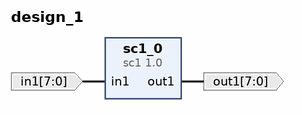
[diagram p0: block diagram of the top level]
# Vivado block design design_1, xc7a100tcsg324-1, Vivado 2023.2
create_bd_design design_1

create_bd_port -dir I -from 7 -to 0 -type data in1
create_bd_port -dir O -from 7 -to 0 -type data out1

create_bd_cell -type ip -vlnv xilinx.com:hls:sc1:1.0 sc1_0

# ---- connections ----

connect_bd_net -net in1_0_1 [get_bd_ports in1] [get_bd_pins sc1_0/in1]
connect_bd_net [get_bd_pins sc1_0/out1] [get_bd_ports out1]

validate_bd_design
save_bd_design
